# Altium project PCB_Project.PrjPcb
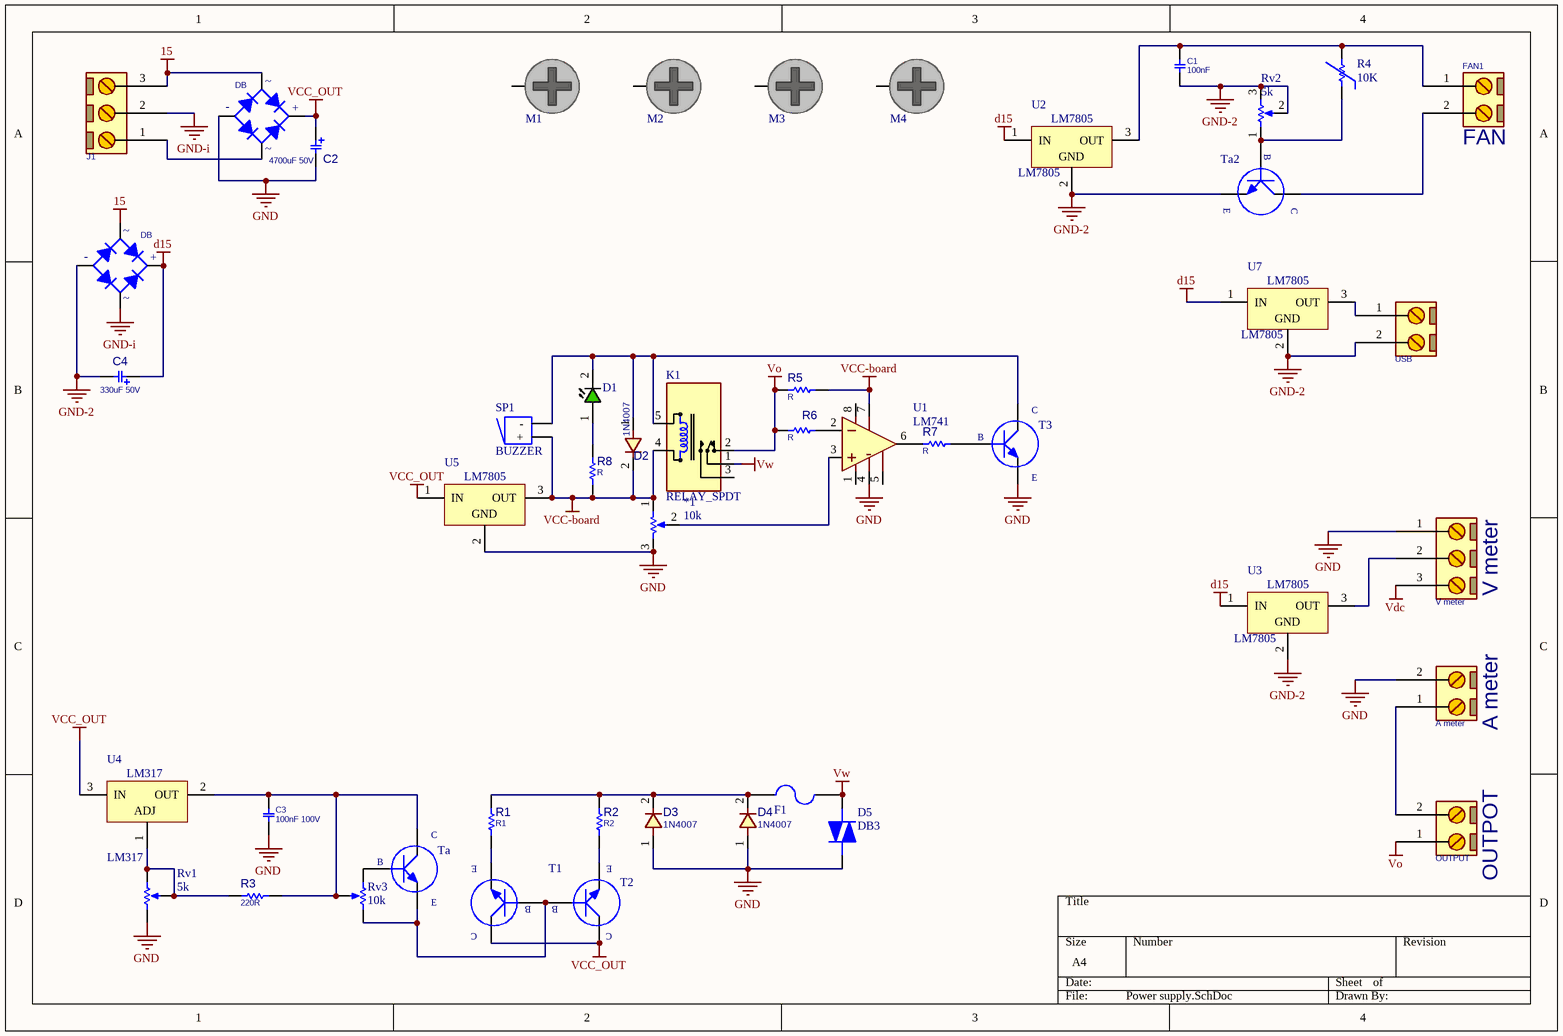
[diagram p0: Power supply.SchDoc]
1 sheet, 47 parts. Net scope: global (net labels, ports and power ports of the same name join across sheets).
Board file: PCB1.PcbDoc

## Sheet Power supply.SchDoc
size A4; SheetNumber: 1; SheetTotal: 1

### Parts
(Parts that share a designator on the sheet are numbered #1, #2 ... from top to bottom, then left to right.)
*1  10k  [POT_7X5]
A_meter  A meter  [TBG_2]
C1  100nF  [C_CER_D6A]
C2  4700uF 50V  [C_EL_20X35]
C3  100nF 100V  [C_CER_D7B]
C4  330uF 50V  [C_EL_10X12]
D1  LED_THD_GRN  [LED5MM_GRN]  (value not drawn)
D2  1N4007  [D_AX04_DO41]
D3  1N4007  [D_AX04_DO41]
D4  1N4007  [D_AX04_DO41]
D5  DB3  [DB3]
DB#1  10A  [BRIDGE-3]  (value not drawn)
DB#2  (no value)  [BRIDGE_DIP]
F1  F=10 A  [Fuse 5x20 With holder pin]  (value not drawn)
FAN1  FAN  [TBG_2]
J1  CONN_TB3  [TBG_3]  (value not drawn)
K1  RELAY_SPDT  [REL_SPDT_5_2216]
M1  DNP/MH  [SCMH_M3]  (value not drawn)  (no BOM)
M2  DNP/MH  [SCMH_M3]  (value not drawn)  (no BOM)
M3  DNP/MH  [SCMH_M3]  (value not drawn)  (no BOM)
M4  DNP/MH  [SCMH_M3]  (value not drawn)  (no BOM)
OUTPUT  OUTPOT  [TBG_2]
R1  value R1  [R5W_AX11]  (hidden comment: 1R 5W)
R2  value R2  [R5W_AX11]  (hidden comment: 1R 5W)
R3  220R  [R025W_AX04]
R4  10K  [NTC Thermistors 10k]
R5  value R  [R025W_AX04]  (hidden comment: 2.2k)
R6  value R  [R025W_AX04]  (hidden comment: 1k)
R7  value R  [R025W_AX04]  (hidden comment: 1k)
R8  value R  [R025W_AX04]  (hidden comment: 390R)
Rv1  5k  [VOL_R]
Rv2  5k  [POT_3296W]
Rv3  10k  [VOL_R]
SP1  BUZZER  [BUZZER 7.62 mm DC]
T1  2N3055  [TO-204]  (value not drawn)
T2  2N3055  [TO-204]  (value not drawn)
T3  BD139  [TO-126]  (value not drawn)
Ta  BD139  [TO-126]  (value not drawn)
Ta2  BD139  [TO-126]  (value not drawn)
U1  LM741  [DIP_8]
U2  LM7805  [TO-220]
U3  LM7805  [TO-220]
U4  LM317  [TO-220]
U5  LM7805  [TO-220]  (value not drawn)
U7  LM7805  [TO-220]
USB  (no value)  [TBB_2]
V_meter  V meter  [TBG_3]

### Nets
15: DB#1.3(C) DB#2.3(C) J1.3
d15: C4.1 DB#2.1(K) U2.1(IN) U3.1(IN) U7.1(IN)
GND: *1.3(BOT) A_meter.2 C2.2 C3.1 D3.1 D4.1 D5.1(A1) DB#1.2(A) Rv1.1(TOP) T3.1(E) U1.4(V-) U5.2(GND) V_meter.1
GND-2: C1.1 C4.2 DB#2.2(A) Rv2.2(TAP) Rv2.3(BOT) Ta2.1(E) U2.2(GND) U3.2(GND) U7.2(GND) USB.2
GND-i: DB#2.4(C) J1.2
VCC-board: *1.1(TOP) D2.2 K1.4(T1) R5.2 R8.1 SP1.1(+) U1.7(V+) U5.3(OUT)
VCC_OUT: C2.1 DB#1.1(K) T1.3(C) T2.3(C) U4.3(IN) U5.1(IN)
Vdc: V_meter.3
Vo: K1.2(NC) OUTPUT.1 R5.1 R6.1
Vw: D5.2(A2) F1.2 K1.1(COM)
Net*1_2: *1.2(TAP) U1.3(IN+)
NetA_meter_1: A_meter.1 OUTPUT.2
NetC1_2: C1.2 FAN1.1 R4.2 U2.3(OUT)
NetC3_2: C3.2 R3.2 Rv3.2(TAP) Ta.2(C) U4.2(OUT)
NetD1_1: D1.1(ANODE) R8.2
NetD1_2: D1.2(CATHODE) D2.1 K1.5(T2) SP1.2(-) T3.2(C)
NetD3_2: D3.2 D4.2 F1.1 R1.2 R2.2
NetDB#1_4: DB#1.4(C) J1.1
NetFAN1_2: FAN1.2 Ta2.2(C)
NetR1_1: R1.1 T1.2(E)
NetR2_1: R2.1 T2.2(E)
NetR3_1: R3.1 Rv1.2(TAP) Rv1.3(BOT) U4.1(ADJ)
NetR4_1: R4.1 Rv2.1(TOP) Ta2.3(B)
NetR6_2: R6.2 U1.2(IN-)
NetR7_1: R7.1 U1.6(OUT)
NetR7_2: R7.2 T3.3(B)
NetRv3_1: Rv3.1(TOP) Ta.3(B)
NetRv3_3: Rv3.3(BOT) T1.1(B) T2.1(B) Ta.1(E)
NetU3_3: U3.3(OUT) V_meter.2
NetU7_3: U7.3(OUT) USB.1

Not connected (* = marked no-connect by the designer): K1 3(NO); M1 1; M2 1; M3 1; M4 1; U1 1(OFFSET_NULL) 5(OFFSET_NULL) 8(NC)

### Notes on the sheet
- (in symbol BRIDGE_DIODE) ~; -; +

### Library data of the parts
*1 = siglar pot
A_meter OUTPUT = CONN_TB2: CONNECTOR 2pin; VALUE: CONN_TB2
C1 C3 = CAP_THD_CERML: CAP, THD, CERAMIC; PARAM: 50V; DESC: CAP, CER MULTI LAYER,; MANF_P#: MANF_PART#; PRICE: 100= 1$; MANF: MANF; PARAM2: PARAM2; ASSEMBLY: ASSEMBLY
  C1: VALUE: 100nF
  C3: VALUE: 100nF 100V
C2 C4 = CAP_THD_EL: CAP, THD, ELEC,; MANF_P#: MANF_PART#; PARAM2: 20%; DESC: DESCRIPTION; DIST#: MOUSER; PARAM: 25V; PRICE: 10= 5$; MANF: MANF; ASSEMBLY: ASSEMBLY
  C2: VALUE: 4700uF 50V
  C4: VALUE: 330uF 50V
D1 = LED_THD_GRN: LED, THD, GREEN; PARAM: *; MANF: *; ASSEMBLY: *; PRICE: *; DESC: *; MANF_P#: *; PARAM2: *; VALUE: *
D2-D4 = DIODE_THD_1N4007: DIODE, GENERAL PURPOSE, 1000V/1A; MANF: Diodes; DESC: DESCRIPTION; PARAM: 1000V, 1.15V; PARAM2: 1.5A; ASSEMBLY: ASSEMBLY; PRICE: PRICE; MANF_P#: 1N4007; VALUE: 1N4007
D5 = DIAC-DB3
DB#1 = BRIDGE_DIODE: DIODE, BRIDGE 10A
DB#2 = BRIDGE_DIODE: DIODE, BRIDGE,
F1 = fuse DIP
FAN1 = CONN_TB2: fan 200mA 5V; VALUE: CONN_TB2
J1 = CONN_TB3: CONN, TERMINAL BLOCK, 5.08mm pitch; VALUE: CONN_TB3
K1 = RELAY_SPDT_5_2913: MANF: OMRON, IDEC; MANF_P#: G2RL-1-E-DC12, RJ1V-C-D12; PARAM2: 16A, 250VAC/24VDC; PARAM: 12V, 33mA, 360Ohm; PRICE: 3$; Value: RELAY_SPDT
M1-M4 = SCMH_M3: SCREW mouting, M3, 3.0mm diameter and 6.0mm PanHead; ASSEMBLY: DNP; VALUE: DNP/MH
R1 R2 R5-R8 = RES_THD: RESISTOR, THD; MANF_P#: RK73H1ETTP4701F; MANF: KOA SPEER; PARAM: 0.063W; DESC: DESCRIPTION; DIST#: MOUSER; PARAM2: 1%; ASSEMBLY: ASSEMBLY; PRICE: 100= 0.5$
R3 = RES_THD: RESISTOR, THD, NORMAL; MANF_P#: RK73H1ETTP4701F; MANF: KOA SPEER; PARAM: 0.063W; DESC: DESCRIPTION; DIST#: MOUSER; PARAM2: 1%; ASSEMBLY: ASSEMBLY; PRICE: 100= 0.5$; VALUE: 220R
R4 = NTC Thermistors
Rv1 Rv3 = siglar pot: VOLUME
Rv2 = siglar pot: POT
T1 T2 = 2N3055: TO-204
U1 = LM741_DIP8: AMP, General-Purpose; MANF: Texas Instruments; MANF_P#: LM741CN; VALUE: LM741
USB = CONN_TB2: CONN, TERMINAL BLOCK, 5.08mm pitch; VALUE: CONN_TB2
V_meter = CONN_TB3: CONNECTOR 3pin; VALUE: CONN_TB3